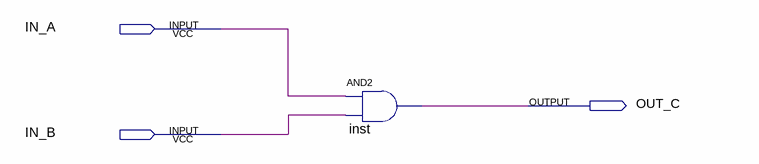
[diagram p0: schematic sheet]
// Quartus schematic ejemplo20211_1.bdf as structural Verilog: 1 symbols, 3 pins
module ejemplo20211_1 (
  input  IN_A,
  input  IN_B,
  output OUT_C
);

  and inst (OUT_C, IN_A, IN_B);
endmodule
